# Altium schematic sheet FE_Channel.SchDoc: ThunderScope 1000E
size A3; DrawnBy: Aleksa Bjelogrlic; Revision: 1
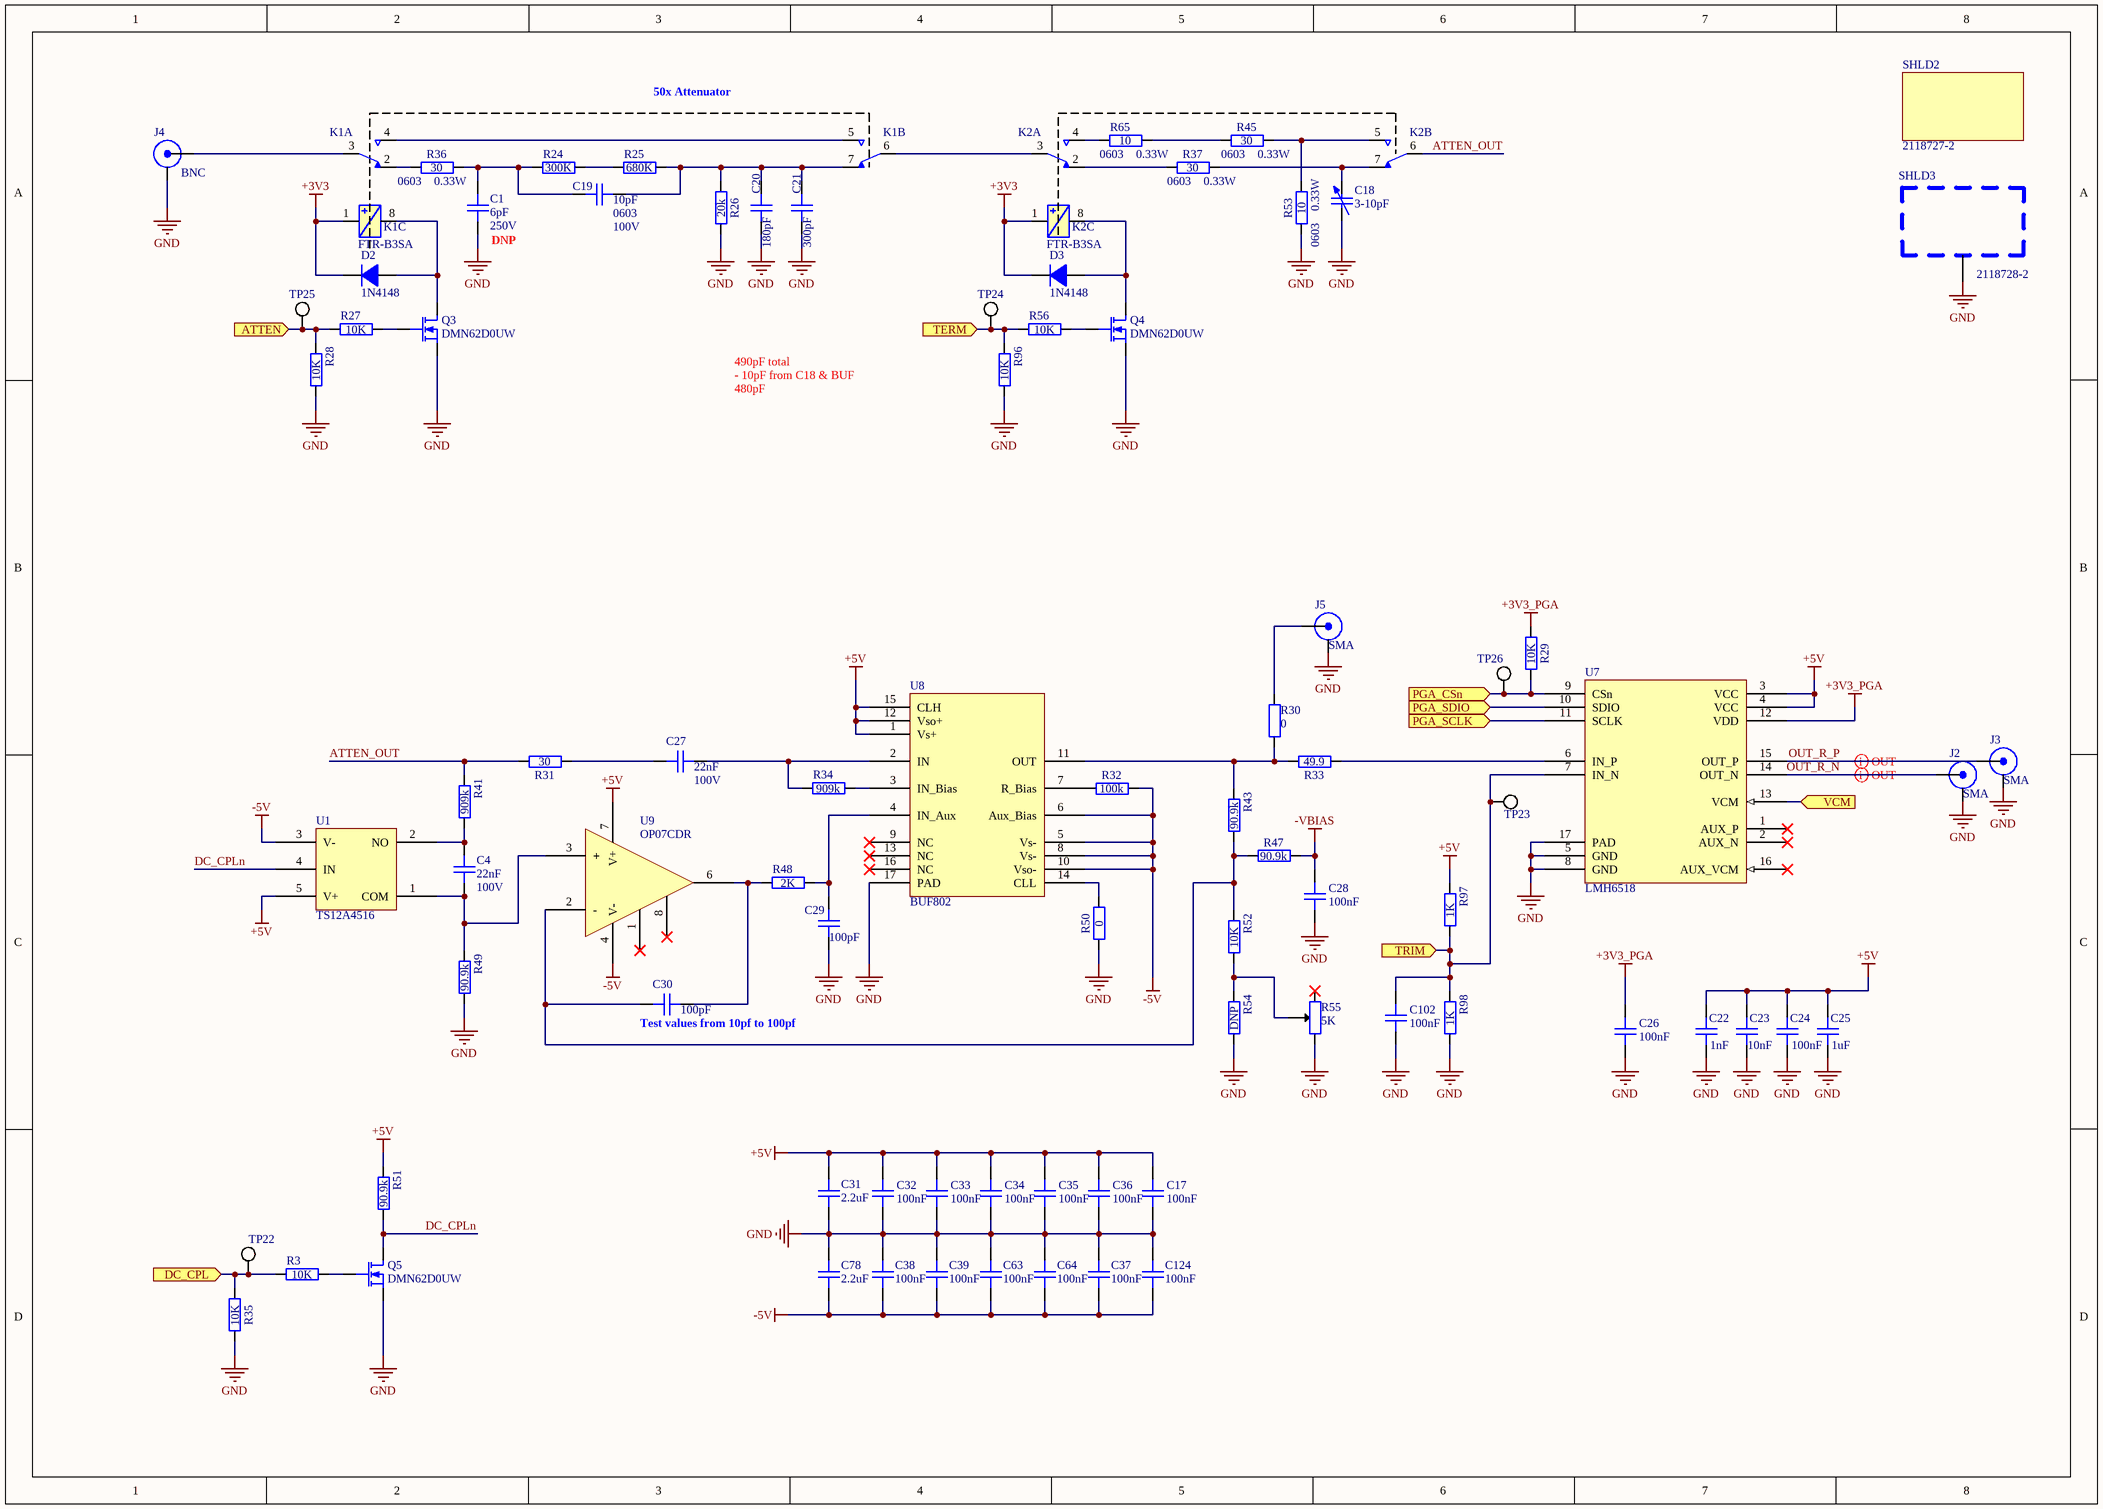
[diagram p0: FE_Channel.SchDoc]

## Parts
C1  6pF  Voltage Rating: 250V  [GEN_C_0603]
C4  22nF  Voltage Rating: 100V  [GEN_C_0603]
C17  100nF  [GEN_C_0402]
C18  3-10pF  [EW_TRIMCAP]
C19  10pF  Package: 0603  Voltage Rating: 100V  [GEN_C_0603]
C20  180pF  [GEN_C_0402]
C21  300pF  [GEN_C_0402]
C22  1nF  [GEN_C_0402]
C23  10nF  [GEN_C_0402]
C24  100nF  [GEN_C_0402]
C25  1uF  [GEN_C_0402]
C26  100nF  [GEN_C_0402]
C27  22nF  Voltage Rating: 100V  [GEN_C_0603]
C28  100nF  [GEN_C_0402]
C29  100pF  [GEN_C_0402]
C30  100pF  [GEN_C_0402]
C31  2.2uF  [GEN_C_0402]
C32  100nF  [GEN_C_0402]
C33  100nF  [GEN_C_0402]
C34  100nF  [GEN_C_0402]
C35  100nF  [GEN_C_0402]
C36  100nF  [GEN_C_0402]
C37  100nF  [GEN_C_0402]
C38  100nF  [GEN_C_0402]
C39  100nF  [GEN_C_0402]
C63  100nF  [GEN_C_0402]
C64  100nF  [GEN_C_0402]
C78  2.2uF  [GEN_C_0402]
C102  100nF  [GEN_C_0402]
C124  100nF  [GEN_C_0402]
D2  1N4148  [GEN_SOD_323]
D3  1N4148  [GEN_SOD_323]
J2  SMA  [MOL_0733910083]
J3  SMA  [MOL_0733910083]
J4  BNC  [MOL_0731000105]
J5  SMA  [MOL_0733910083]
K1  FTR-B3SA  [FUJ_FTR-B3SA]  (value not drawn)  (parts A,B,C of 3)
K2  FTR-B3SA  [FUJ_FTR-B3SA]  (value not drawn)  (parts A,B,C of 3)
Q3  DMN62D0UW  [GEN_SOT_323]
Q4  DMN62D0UW  [GEN_SOT_323]
Q5  DMN62D0UW  [GEN_SOT_323]
R3  10K  [GEN_R_0402]
R24  300K  [GEN_R_0402]
R25  680K  [GEN_R_0402]
R26  20k  [GEN_R_0402]
R27  10K  [GEN_R_0402]
R28  10K  [GEN_R_0402]
R29  10K  [GEN_R_0402]
R30  0  [GEN_R_0402]
R31  30  [GEN_R_0603]
R32  100k  [GEN_R_0402]
R33  49.9  [GEN_R_0402]
R34  909k  [GEN_R_0402]
R35  10K  [GEN_R_0402]
R36  30  Power Rating: 0.33W  Package: 0603  [GEN_R_0603]
R37  30  Power Rating: 0.33W  Package: 0603  [GEN_R_0603]
R41  909k  [GEN_R_0402]
R43  90.9k  [GEN_R_0402]
R45  30  Power Rating: 0.33W  Package: 0603  [GEN_R_0603]
R47  90.9k  [GEN_R_0402]
R48  2K  [GEN_R_0402]
R49  90.9k  [GEN_R_0402]
R50  0  [GEN_R_0402]
R51  90.9k  [GEN_R_0402]
R52  10K  [GEN_R_0402]
R53  10  Power Rating: 0.33W  Package: 0603  [GEN_R_0603]
R54  DNP  [GEN_R_0402]  (no BOM)
R55  5K  [BOU_3mm_POT]
R56  10K  [GEN_R_0402]
R65  10  Package: 0603  Power Rating: 0.33W  [GEN_R_0603]
R96  10K  [GEN_R_0402]
R97  1K  [GEN_R_0402]
R98  1K  [GEN_R_0402]
SHLD2  2118727-2  (mechanical)
SHLD3  2118728-2  [TE_2118728-2]
TP22  PCB  [GEN_TP_PCB]  (value not drawn)  (no BOM)
TP23  PCB  [GEN_TP_PCB]  (value not drawn)  (no BOM)
TP24  PCB  [GEN_TP_PCB]  (value not drawn)  (no BOM)
TP25  PCB  [GEN_TP_PCB]  (value not drawn)  (no BOM)
TP26  PCB  [GEN_TP_PCB]  (value not drawn)  (no BOM)
U1  TS12A4516  [GEN_SOT23_5_950_2900X1600X1450]
U7  LMH6518  [TI_WQFN_RGH0016A]
U8  BUF802  [TI_VQFN_RGT0016C]
U9  OP07CDR  [TI_SOIC8_D0008A]

## Ports
ATTEN (in), DC_CPL (in), PGA_CSn (in), PGA_SCLK (in), PGA_SDIO (in), TERM (in), TRIM (in), VCM (in)

## Nets
+3V3: D2.1(K) D3.1(K) K1.1 K2.1
+3V3_PGA: C26.2 R29.2 U7.12(VDD)
+5V: C17.2 C22.2 C23.2 C24.2 C25.2 C31.2 C32.1 C33.1 C34.1 C35.2 C36.2 R51.2 R97.2 U1.5(V+) U7.3(VCC) U7.4(VCC) U8.1(Vs+) U8.12(Vso+) U8.15(CLH) U9.7(V+)
-5V: C37.2 C38.2 C39.1 C63.1 C64.1 C78.2 C124.2 R32.2 U1.3(V-) U8.5(Vs-) U8.6(Aux_Bias) U8.8(Vs-) U8.10(Vso-) U9.4(V-)
-VBIAS: C28.1 R47.1
GND: C1.1 C17.1 C18.2 C20.1 C21.1 C22.1 C23.1 C24.1 C25.1 C26.1 C28.2 C29.1 C31.1 C32.2 C33.2 C34.2 C35.1 C36.1 C37.1 C38.1 C39.2 C63.2 C64.2 C78.1 C102.2 C124.1 J2.2(SHIELD) J3.2(SHIELD) J4.2(SHIELD) J5.2(SHIELD) Q3.3(S) Q4.3(S) Q5.3(S) R26.1 R28.1 R35.1 R49.1 R50.1 R53.1 R54.1 R55.3 R96.1 R98.1 SHLD3.1 U7.5(GND) U7.8(GND) U7.17(PAD) U8.17(PAD)
ATTEN: R27.2 R28.2 TP25.1 ; port ATTEN
ATTEN_OUT: K2.6 R31.1 R41.2
DC_CPL: R3.2 R35.2 TP22.1 ; port DC_CPL
DC_CPLn: Q5.1(D) R51.1 U1.4(IN)
OUT_R_N: J2.1(Signal) U7.14(OUT_N)
OUT_R_P: J3.1(Signal) U7.15(OUT_P)
PGA_CSn: R29.1 TP26.1 U7.9(CSn) ; port PGA_CSn
PGA_SCLK: U7.11(SCLK) ; port PGA_SCLK
PGA_SDIO: U7.10(SDIO) ; port PGA_SDIO
TERM: R56.2 R96.2 TP24.1 ; port TERM
TRIM: C102.1 R97.1 R98.2 TP23.1 U7.7(IN_N) ; port TRIM
VCM: U7.13(VCM) ; port VCM
NetC1_2: C1.2 C19.2 R24.1 R36.2
NetC4_1: C4.1 R41.1 U1.2(NO)
NetC4_2: C4.2 R49.2 U1.1(COM) U9.3(+)
NetC18_1: C18.1 K2.7 R37.2
NetC19_1: C19.1 C20.2 C21.2 K1.7 R25.2 R26.2
NetC27_1: C27.1 R34.2 U8.2(IN)
NetC27_2: C27.2 R31.2
NetC29_2: C29.2 R48.1 U8.4(IN_Aux)
NetC30_1: C30.1 R48.2 U9.6(OUT)
NetC30_2: C30.2 R43.1 R47.2 R52.2 U9.2(-)
NetD2_2: D2.2(A) K1.8 Q3.1(D)
NetD3_2: D3.2(A) K2.8 Q4.1(D)
NetJ4_1: J4.1(Signal) K1.3
NetJ5_1: J5.1(Signal) R30.2
NetK1_2: K1.2 R36.1
NetK1_4: K1.4 K1.5
NetK1_6: K1.6 K2.3
NetK2_2: K2.2 R37.1
NetK2_4: K2.4 R65.1
NetK2_5: K2.5 R45.2 R53.2
NetQ3_2: Q3.2(G) R27.1
NetQ4_2: Q4.2(G) R56.1
NetQ5_2: Q5.2(G) R3.1
NetR24_2: R24.2 R25.1
NetR30_1: R30.1 R33.1 R43.2 U8.11(OUT)
NetR32_1: R32.1 U8.7(R_Bias)
NetR33_2: R33.2 U7.6(IN_P)
NetR34_1: R34.1 U8.3(IN_Bias)
NetR45_1: R45.1 R65.2
NetR50_2: R50.2 U8.14(CLL)
NetR52_1: R52.1 R54.2 R55.2

Not connected (* = marked no-connect by the designer): R55 1*; U7 1(AUX_P)* 2(AUX_N)* 16(AUX_VCM)*; U8 9(NC)* 13(NC)* 16(NC)*; U9 1(N1)* 8(N2)*

## Layout directives
differential pair; differential pair class 100Z_Diff_PGA: OUT_R_N, OUT_R_P

## Notes on the sheet
- 50x Attenuator
- (near C1) DNP
- 490pF total
- - 10pF from C18 & BUF
- 480pF
- (near C30) Test values from 10pf to 100pf

## Library data of the parts
C1 = CAP 6pF 250V C0G 0603: Manufacturer: KEMET; Manufacturer Part Number: CBR06C609BAGAC; Supplier 1: Digi-Key; Supplier Part Number 1: 399-8734-1-ND; Package: 0603; Value: 6pF
C4 C27 = CAP 22nF 100V X7R 0603: Package: 0603; Value: 22nF; Supplier 1: Digi-Key; Supplier Part Number 1: 490-4782-1-ND
C17 C24 C26 C28 C32-C39 C63 C64 C102 C124 = CAP 100nF 16V X7R 0402: Voltage Rating: 16V; Package: 0402; Supplier 1: Digi-Key; Supplier Part Number 1: 490-4759-1-ND; Value: 100nF
C18 = CAP TRIMMER 3-10PF 100V SMD: Manufacturer: Panasonic; Manufacturer Part Number: SGC3S100; Value: 3-10pF; Supplier 1: Digi-Key; Supplier Part Number 1: 2447-SGC3S100CT-ND
C19 = CAP 10pF 100V C0G 0603: Supplier 1: Digi-Key; Supplier Part Number 1: 478-5769-1-ND; Value: 10pF
C20 = CAP 180pF 50V C0G 0402: Manufacturer: Murata; Manufacturer Part Number: GCM1555C1H301FA16D; Voltage Rating: 50V; Temperature Coefficient: C0G; Package: 0402; Supplier 1: Digi-Key; Supplier Part Number 1: 490-16455-1-ND; Value: 180pF
C21 = CAP 300pF 50V C0G 0402: Voltage Rating: 50V; Temperature Coefficient: C0G; Package: 0402; Supplier 1: Digi-Key; Supplier Part Number 1: 490-GCM1555C1H301FA16DCT-ND; Value: 300pF
C22 = CAP 1nF 50V C0G 0402: Voltage Rating: 50V; Package: 0402; Supplier 1: Digi-Key; Supplier Part Number 1: 490-6189-1-ND; Value: 1nF
C23 = CAP 10nF 50V X7R 0402: Voltage Rating: 50V; Package: 0402; Supplier 1: Digi-Key; Supplier Part Number 1: 490-6351-1-ND; Value: 10nF
C25 = CAP 1uF 25V X5R 0402: Voltage Rating: 25V; Package: 0402; Supplier 1: Digi-Key; Supplier Part Number 1: 490-10017-1-ND; Value: 1uF
C29 C30 = CAP 100pF 50V C0G 0402: Temperature Coefficient: C0G; Voltage Rating: 50V; Package: 0402; Value: 100pF; Supplier 1: Digi-Key; Supplier Part Number 1: 490-14349-1-ND
C31 C78 = CAP 2.2uF 10V X5R 0402: Voltage Rating: 10V; Package: 0402; Supplier 1: Digi-Key; Supplier Part Number 1: 587-3153-1-ND; Value: 2.2uF
D2 D3 = DIODE 1N4148: Max Reverse Voltage: 75V; Max Current: 150mA; Supplier 1: Digi-Key; Supplier Part Number 1: 1N4148WS-FDICT-ND
J2 J3 J5 = SMA JACK R/A: Manufacturer: Molex; Manufacturer Part Number: 73100-0105; Supplier 1: Digi-Key; Supplier Part Number 1: WM26450-ND
J4 = BNC JACK R/A: Supplier 1: Digi-Key; Supplier Part Number 1: WM5524-ND
K1 K2 = RELAY DPDT-NO FTR-B3SA: Supplier 1: Mouser; Supplier Part Number 1: 817-FTR-B3SA003Z
Q3-Q5 = NMOS DMN62D0UW: Vdss: 60V; Id: 340mA; Max Power: 320mW; Supplier 1: Digi-Key; Supplier Part Number 1: DMN62D0UW-7DICT-ND
R3 R27-R29 R52 R56 R96 = RES 10K OHM 1% 1/10W 0402: Tolerance: 1%; Power Rating: 0.1W; Package: 0402; Supplier 1: Digi-Key; Supplier Part Number 1: P10.0KLCT-ND; Value: 10K
R24 = RES 300K OHM 1% 1/10W 0402: Manufacturer: Panasonic; Manufacturer Part Number: ERJ-2RKF3003X; Tolerance: 1%; Package: 0402; Supplier 1: Digi-Key; Supplier Part Number 1: P300KLCT-ND; Value: 300K
R25 = RES 680K OHM 1% 1/16W 0402: Manufacturer: Yageo; Manufacturer Part Number: RC0402FR-07681KL; Tolerance: 1%; Package: 0402; Supplier 1: Digi-Key; Supplier Part Number 1: YAG3211CT-ND; Value: 680K
R26 = RES 20K OHM 1% 1/16W 0402: Manufacturer: Yageo; Manufacturer Part Number: RC0402FR-0720KL; Tolerance: 1%; Package: 0402; Supplier 1: Digi-Key; Supplier Part Number 1: 311-20.0KLRCT-ND; Value: 20k
R30 = RES 0 OHM 1/16W 0402: Manufacturer: Yageo; Manufacturer Part Number: RC0402JR-070RL; Package: 0402; Value: 0; Supplier 1: Digi-Key; Supplier Part Number 1: 311-0.0JRCT-ND
R31 = RES 30 OHM 1% 1/3W 0603: Manufacturer: KOA Speer; Manufacturer Part Number: SG73P1JTTD30R0F; Tolerance: 1%; Package: 0603; Value: 30; Supplier 1: Digi-Key; Supplier Part Number 1: 2019-SG73P1JTTD30R0FCT-ND
R32 = RES 100K OHM 1% 1/10W 0402: Tolerance: 1%; Power Rating: 0.1W; Package: 0402; Value: 100k; Supplier 1: Digi-Key; Supplier Part Number 1: 311-100KLRCT-ND
R33 = RES 49.9 OHM 1% 1/10W 0402: Manufacturer: Yageo; Manufacturer Part Number: RC0402FR-0749R9L; Tolerance: 1%; Package: 0402; Value: 49.9; Supplier 1: Digi-Key; Supplier Part Number 1: 311-49.9LRCT-ND
R34 R41 = RES 909K OHM 1% 1/16W 0402: Tolerance: 1%; Power Rating: 0.0625W; Package: 0402; Supplier 1: Digi-Key; Supplier Part Number 1: YAG2377CT-ND; Value: 909k
R35 = RES 10K OHM 1% 1/10W 0402: Manufacturer: Panasonic; Manufacturer Part Number: ERJ-2RKF1002X; Tolerance: 1%; Package: 0402; Supplier 1: Digi-Key; Supplier Part Number 1: P10.0KLCT-ND; Value: 10K
R36 R37 R45 = RES 30 OHM 1% 1/3W 0603: Tolerance: 1%; Value: 30; Supplier 1: Digi-Key; Supplier Part Number 1: 2019-SG73P1JTTD30R0FCT-ND
R43 R47 R49 R51 = RES 90.9K OHM 1% 1/16W 0402: Tolerance: 1%; Power Rating: 0.0625W; Package: 0402; Supplier 1: Digi-Key; Supplier Part Number 1: 311-90.9KLRCT-ND; Value: 90.9k
R48 = RES 2K OHM 1% 1/16W 0402: Tolerance: 1%; Power Rating: 0.0625W; Package: 0402; Supplier 1: Digi-Key; Supplier Part Number 1: 311-2KLRCT-ND; Value: 2K
R50 = RES 0 OHM 1/16W 0402: Power Rating: 0.0625W; Package: 0402; Supplier 1: Digi-Key; Supplier Part Number 1: 311-0.0JRCT-ND; Value: 0
R53 R65 = RES 10 OHM 1% 1/3W 0603: Tolerance: 1%; Value: 10; Supplier 1: Digi-Key; Supplier Part Number 1: 2019-SG73P1JTTD10R0FCT-ND
R54 = RES DNP 0402: Tolerance: 1%; Power Rating: 0.0625W; Package: 0402; Value: DNP
R55 = TRIMMER 5K OHM 0.1W J LEAD TOP: Tolerance: 1%; Power Rating: 0.1W; Supplier 1: Digi-Key; Supplier Part Number 1: TC33X-502ECT-ND; Value: 5K
R97 R98 = RES 1K OHM 1% 1/10W 0402: Tolerance: 1%; Power Rating: 0.1W; Package: 0402; Supplier 1: Digi-Key; Supplier Part Number 1: 311-1.00KLRCT-ND; Value: 1K
SHLD2 = SHIELD 2118727-2: Supplier 1: Digi-Key; Supplier Part Number 1: A126132-ND
SHLD3 = SHIELD 2118728-2: Supplier 1: Digi-Key; Supplier Part Number 1: A126158CT-ND
TP22-TP26 = TP PCB 1mm
U1 = IC SWITCH SPST TS12A4516DBVR: Manufacturer: Texas Instruments; Supplier 1: Digi-Key; Supplier Part Number 1: 296-24269-1-ND; Manufacturer Part Number: TS12A4516DBVR
U7 = IC PGA LMH6518: Supplier 1: Digi-Key; Supplier Part Number 1: LMH6518SQE/NOPBCT-ND
U8 = IC BUFFER AMP BUF802: Supplier 1: Mouser; Supplier Part Number 1: 595-BUF802IRGTR
U9 = IC OPAMP OP07CDR: Supplier 1: Digi-Key; Supplier Part Number 1: 296-14626-1-ND